# Altium project TIDA-010933-RevA.PrjPcb (part 3 of 8)

## Sheet TIDA-010933-DCDC-HVGAN.SchDoc
size 431 x 279 mm; Date: Not shown in title block; ApprovedBy: Not shown in title block; CheckedBy: Not shown in title block; Author: Not shown in title block; CompanyName: Not shown in title block; Engineer: Not shown in title block; Organization: Not shown in title block; Address1: Not shown in title block; Address2: Not shown in title block; Address3: Not shown in title block; Address4: Not shown in title block; DocumentNumber: 2; Revision: Use project parameter SCH_Rev; SheetNumber: 4; SheetTotal: 11; PageSetup: Record=PageOptions|CenterHorizontal=True|CenterVertical=True|PrintScale=1.00|XCorrection=1.00|YCorrection=1.00|PrintKind=0|BorderSize=5000000|LeftOffset=0|BottomOffset=0|Orientation=2|PaperLength=1000|PaperWidth=1000|Scale=100|PaperSource=15|PrintQuality=600|MediaType=1|DitherType=10|PaperKind=Letter|PrintScaleMode=1; CurrentTime: Not shown in title block; CurrentDate: Not shown in title block; Time: Not shown in title block; DocumentFullPathAndName: Not shown in title block; DocumentName: Not shown in title block; ModifiedDate: 1/25/2022; ImagePath: Not shown in title block
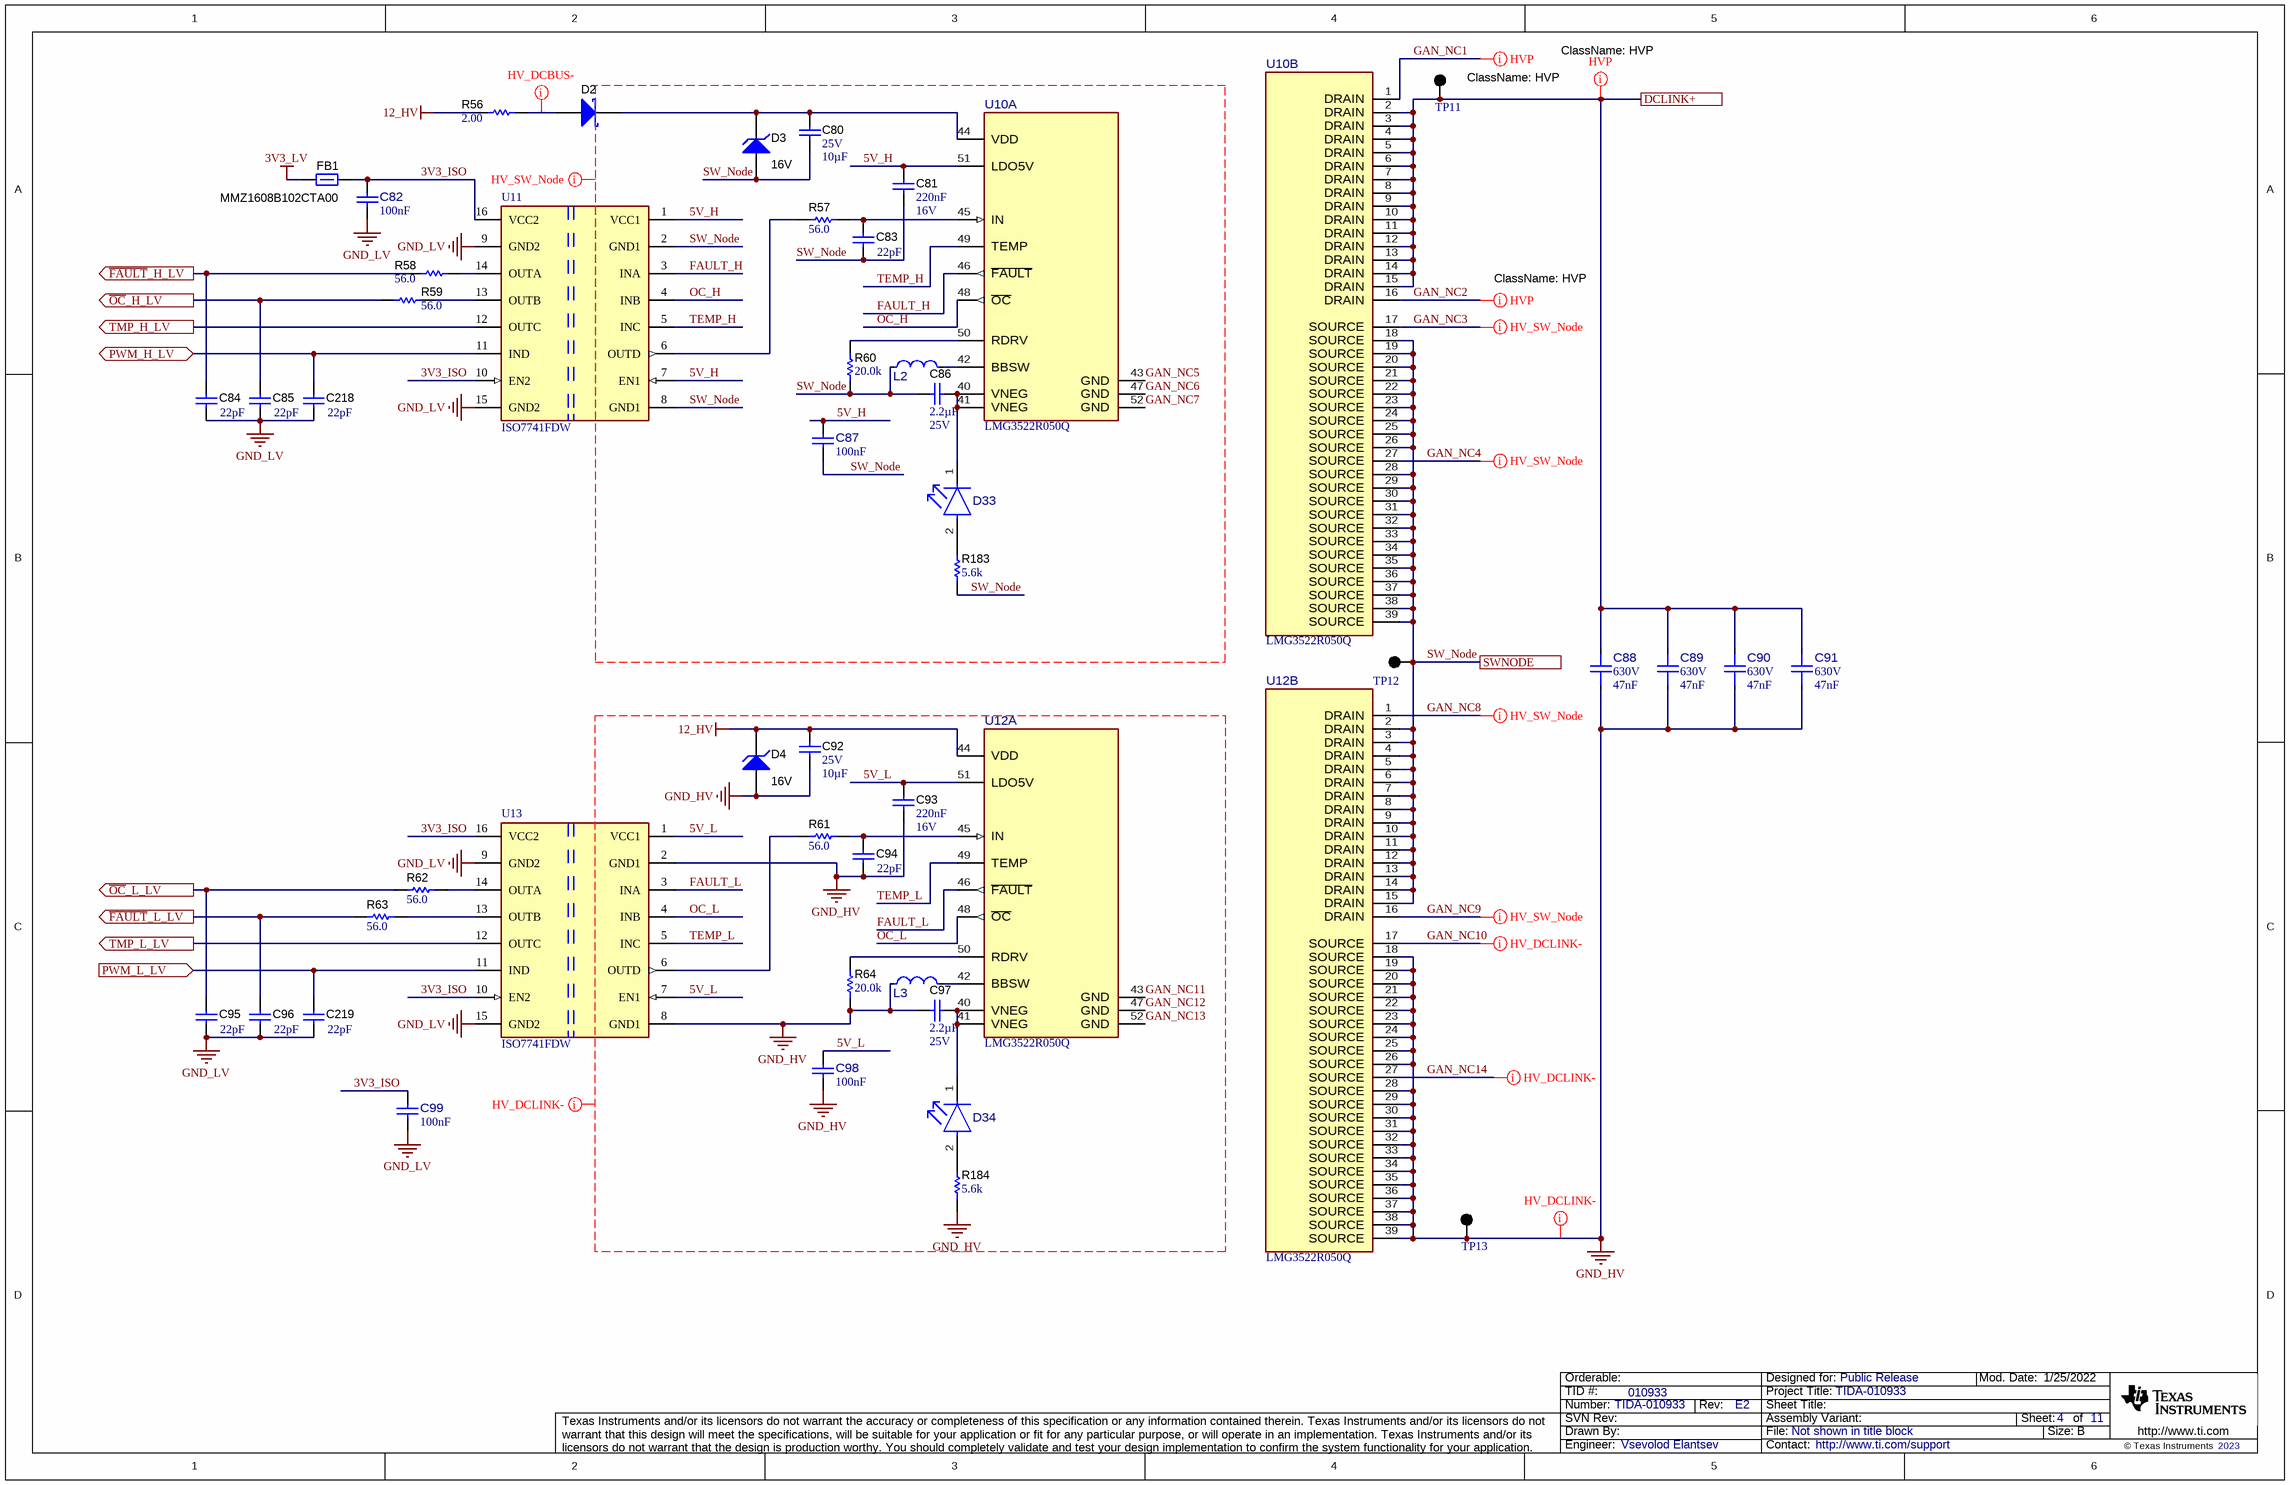
[diagram p3: TIDA-010933-DCDC-HVGAN.SchDoc]

### Parts
C80  VDC_V: 25V  ValueDisplayed: 10µF  [1206_180]  (hidden comment: TMK316AB7106KLHT)
C81  Cap_F: 220nF  VDC_V: 16V  [0603]  (hidden comment: GRM188R71C224KA01D)
C82  Cap_F: 100nF  [FP-CL10B104KB8NNNC_0603-IPC_B]  (hidden comment: CL10B104KB8NNNC)
C83  ValueDisplayed: 22pF  [0603]  (hidden comment: GRM1885C1H220JA01D)
C84  ValueDisplayed: 22pF  [0603]  (hidden comment: GRM1885C1H220JA01D)
C85  ValueDisplayed: 22pF  [0603]  (hidden comment: GRM1885C1H220JA01D)
C86  Cap_F: 2.2µF  VDC_V: 25V  [0805_HV]  (hidden comment: CGA4J3X7R1E225K125AB)
C87  Cap_F: 100nF  [FP-CL10B104KB8NNNC_0603-IPC_B]  (hidden comment: CL10B104KB8NNNC)
C88  VDC_V: 630V  ValueDisplayed: 47nF  [FP-C4532C0G2J473J320KA_1812-MFG]  (hidden comment: C4532C0G2J473J320KA)
C89  VDC_V: 630V  ValueDisplayed: 47nF  [FP-C4532C0G2J473J320KA_1812-MFG]  (hidden comment: C4532C0G2J473J320KA)
C90  VDC_V: 630V  ValueDisplayed: 47nF  [FP-C4532C0G2J473J320KA_1812-MFG]  (hidden comment: C4532C0G2J473J320KA)
C91  VDC_V: 630V  ValueDisplayed: 47nF  [FP-C4532C0G2J473J320KA_1812-MFG]  (hidden comment: C4532C0G2J473J320KA)
C92  VDC_V: 25V  ValueDisplayed: 10µF  [1206_180]  (hidden comment: TMK316AB7106KLHT)
C93  Cap_F: 220nF  VDC_V: 16V  [0603]  (hidden comment: GRM188R71C224KA01D)
C94  ValueDisplayed: 22pF  [0603]  (hidden comment: GRM1885C1H220JA01D)
C95  ValueDisplayed: 22pF  [0603]  (hidden comment: GRM1885C1H220JA01D)
C96  ValueDisplayed: 22pF  [0603]  (hidden comment: GRM1885C1H220JA01D)
C97  Cap_F: 2.2µF  VDC_V: 25V  [0805_HV]  (hidden comment: CGA4J3X7R1E225K125AB)
C98  Cap_F: 100nF  [FP-CL10B104KB8NNNC_0603-IPC_B]  (hidden comment: CL10B104KB8NNNC)
C99  Cap_F: 100nF  [FP-CL10B104KB8NNNC_0603-IPC_B]  (hidden comment: CL10B104KB8NNNC)
C218  ValueDisplayed: 22pF  [0603]  (hidden comment: GRM1885C1H220JA01D)
C219  ValueDisplayed: 22pF  [0603]  (hidden comment: GRM1885C1H220JA01D)
D2  GB01SLT06-214  [SMB]  (value not drawn)
D3  value 16V  [SOD-123]  (hidden comment: BZT52C16-7-F)
D4  value 16V  [SOD-123]  (hidden comment: BZT52C16-7-F)
D33  KG DELLS1.22-JGKH-24  [FP-KG DELLS1.22-JGKH-24_0603-MFG]  (value not drawn)
D34  KG DELLS1.22-JGKH-24  [FP-KG DELLS1.22-JGKH-24_0603-MFG]  (value not drawn)
FB1  MMZ1608B102CTA00  [MMZ1608_095]
L2  SDEM20161T-4R7MS  [FP-SDEM20161T-4R7MS_SMD2-MFG]  (value not drawn)
L3  SDEM20161T-4R7MS  [FP-SDEM20161T-4R7MS_SMD2-MFG]  (value not drawn)
R56  ValueDisplayed: 2.00  [0805_HV]  (hidden comment: CRCW08052R00FKEA)
R57  ValueDisplayed: 56.0  [0603]  (hidden comment: RC0603FR-0756RL)
R58  ValueDisplayed: 56.0  [0603]  (hidden comment: RC0603FR-0756RL)
R59  ValueDisplayed: 56.0  [0603]  (hidden comment: RC0603FR-0756RL)
R60  ValueDisplayed: 20.0k  [0603]  (hidden comment: RC0603FR-0720KL)
R61  ValueDisplayed: 56.0  [0603]  (hidden comment: RC0603FR-0756RL)
R62  ValueDisplayed: 56.0  [0603]  (hidden comment: RC0603FR-0756RL)
R63  ValueDisplayed: 56.0  [0603]  (hidden comment: RC0603FR-0756RL)
R64  ValueDisplayed: 20.0k  [0603]  (hidden comment: RC0603FR-0720KL)
R183  ValueDisplayed: 5.6k  [0603]  (hidden comment: RC0603JR-075K6L)
R184  ValueDisplayed: 5.6k  [0603]  (hidden comment: RC0603JR-075K6L)
TP11  5001  [Keystone5001]  (value not drawn)
TP12  5001  [Keystone5001]  (value not drawn)
TP13  5001  [Keystone5001]  (value not drawn)
U10  PartNumber: LMG3522R050Q  [RQS0052C-C01-MFG]  (hidden comment: LMG3522R030Q)  (parts A,B of 2)
U11  ISO7741FDW  [FP-DW0016A-IPC_A]
U12  PartNumber: LMG3522R050Q  [RQS0052C-C01-MFG]  (hidden comment: LMG3522R030Q)  (parts A,B of 2)
U13  ISO7741FDW  [FP-DW0016A-IPC_A]

### Ports
DCLINK+, PWM_H_LV (bidir), PWM_L_LV (in), SWNODE, TMP_H_LV (out), TMP_L_LV (out), ~{FAULT}_H_LV (out), ~{FAULT}_L_LV (out), ~{OC}_H_LV (out), ~{OC}_L_LV (out)

### Nets
3V3_LV: FB1.1  [project net 3V3]
12_HV: C92.1 D4.1(K) R56.1 U12.44(VDD)
GND_HV: C88.1 C89.1 C90.1 C91.1 C92.2 C93.2 C94.2 C97.2 C98.2 D4.2(A) L3.1 R64.1 R184.1 TP13.1 U12.18(SOURCE) U12.19(SOURCE) U12.20(SOURCE) U12.21(SOURCE) U12.22(SOURCE) U12.23(SOURCE) U12.24(SOURCE) U12.25(SOURCE) U12.26(SOURCE) U12.28(SOURCE) U12.29(SOURCE) U12.30(SOURCE) U12.31(SOURCE) U12.32(SOURCE) U12.33(SOURCE) U12.34(SOURCE) U12.35(SOURCE) U12.36(SOURCE) U12.37(SOURCE) U12.38(SOURCE) U12.39(SOURCE) U13.2(GND1) U13.8(GND1)
GND_LV: C82.2 C84.2 C85.2 C95.2 C96.2 C99.2 C218.2 C219.2 U11.9(GND2) U11.15(GND2) U13.9(GND2) U13.15(GND2)  [project net GND]
3V3_ISO: C82.1 C99.1 FB1.2 U11.10(EN2) U11.16(VCC2) U13.10(EN2) U13.16(VCC2)
5V_H: C81.1 C87.1 U10.51(LDO5V) U11.1(VCC1) U11.7(EN1)
5V_L: C93.1 C98.1 U12.51(LDO5V) U13.1(VCC1) U13.7(EN1)
DCLINK+_HV: C88.2 C89.2 C90.2 C91.2 TP11.1 U10.2(DRAIN) U10.3(DRAIN) U10.4(DRAIN) U10.5(DRAIN) U10.6(DRAIN) U10.7(DRAIN) U10.8(DRAIN) U10.9(DRAIN) U10.10(DRAIN) U10.11(DRAIN) U10.12(DRAIN) U10.13(DRAIN) U10.14(DRAIN) U10.15(DRAIN) ; port DCLINK+
FAULT_H: U10.46(~{FAULT}) U11.3(INA)
FAULT_L: U12.46(~{FAULT}) U13.3(INA)
GAN_NC1: U10.1(DRAIN)
GAN_NC2: U10.16(DRAIN)
GAN_NC3: U10.17(SOURCE)
GAN_NC4: U10.27(SOURCE)
GAN_NC5: U10.43(GND)
GAN_NC6: U10.47(GND)
GAN_NC7: U10.52(GND)
GAN_NC8: U12.1(DRAIN)
GAN_NC9: U12.16(DRAIN)
GAN_NC10: U12.17(SOURCE)
GAN_NC11: U12.43(GND)
GAN_NC12: U12.47(GND)
GAN_NC13: U12.52(GND)
GAN_NC14: U12.27(SOURCE)
LLC_SR_~{FAULT}_H: C84.1 R58.1 ; port ~{FAULT}_H_LV
LLC_SR_~{FAULT}_L: C96.1 R63.1 ; port ~{FAULT}_L_LV
LLC_SR_H: C218.1 U11.11(IND) ; port PWM_H_LV
LLC_SR_L: C219.1 U13.11(IND) ; port PWM_L_LV
LLC_SR_~{OC}_H: C85.1 R59.1 ; port ~{OC}_H_LV
LLC_SR_~{OC}_L: C95.1 R62.1 ; port ~{OC}_L_LV
LLC_SR_TMP_H: U13.12(OUTC) ; port TMP_L_LV
LLC_SR_TMP_L: U11.12(OUTC) ; port TMP_H_LV
OC_H: U10.48(~{OC}) U11.4(INB)
OC_L: U12.48(~{OC}) U13.4(INB)
SW_Node: C80.2 C81.2 C83.2 C86.2 C87.2 D3.2(A) L2.1 R60.1 R183.1 TP12.1 U10.18(SOURCE) U10.19(SOURCE) U10.20(SOURCE) U10.21(SOURCE) U10.22(SOURCE) U10.23(SOURCE) U10.24(SOURCE) U10.25(SOURCE) U10.26(SOURCE) U10.28(SOURCE) U10.29(SOURCE) U10.30(SOURCE) U10.31(SOURCE) U10.32(SOURCE) U10.33(SOURCE) U10.34(SOURCE) U10.35(SOURCE) U10.36(SOURCE) U10.37(SOURCE) U10.38(SOURCE) U10.39(SOURCE) U11.2(GND1) U11.8(GND1) U12.2(DRAIN) U12.3(DRAIN) U12.4(DRAIN) U12.5(DRAIN) U12.6(DRAIN) U12.7(DRAIN) U12.8(DRAIN) U12.9(DRAIN) U12.10(DRAIN) U12.11(DRAIN) U12.12(DRAIN) U12.13(DRAIN) U12.14(DRAIN) U12.15(DRAIN) ; port SWNODE
TEMP_H: U10.49(TEMP) U11.5(INC)
TEMP_L: U12.49(TEMP) U13.5(INC)
NetC80_1: C80.1 D2.1(K) D3.1(K) U10.44(VDD)
NetC83_1: C83.1 R57.2 U10.45(IN)
NetC86_1: C86.1 D33.1(CATHODE) U10.40(VNEG) U10.41(VNEG)
NetC94_1: C94.1 R61.2 U12.45(IN)
NetC97_1: C97.1 D34.1(CATHODE) U12.40(VNEG) U12.41(VNEG)
NetD2_2: D2.2(A) R56.2
NetD33_2: D33.2(ANODE) R183.2
NetD34_2: D34.2(ANODE) R184.2
NetL2_2: L2.2 U10.42(BBSW)
NetL3_2: L3.2 U12.42(BBSW)
NetR57_1: R57.1 U11.6(OUTD)
NetR58_2: R58.2 U11.14(OUTA)
NetR59_2: R59.2 U11.13(OUTB)
NetR60_2: R60.2 U10.50(RDRV)
NetR61_1: R61.1 U13.6(OUTD)
NetR62_2: R62.2 U13.14(OUTA)
NetR63_2: R63.2 U13.13(OUTB)
NetR64_2: R64.2 U12.50(RDRV)

### Layout directives
net class HV_SW_Node: 5V_H, FAULT_H, GAN_NC3, GAN_NC4, GAN_NC5, GAN_NC6, GAN_NC7, GAN_NC8, GAN_NC9, OC_H, SW_Node, TEMP_H
net class HV_DCBUS-: NetD2_2
net class HV_DCLINK-: 5V_L, 12_HV, FAULT_L, GAN_NC10, GAN_NC11, GAN_NC12, GAN_NC13, GAN_NC14, GND_HV, OC_L, TEMP_L
net class HVP: DCLINK+_HV, GAN_NC1, GAN_NC2

### Notes on the sheet
- Drawn By:
- SVN Rev:
- Number:
- TID #:
- Orderable:
- Rev:
- Sheet Title:
- File:
- Project Title:
- Designed for:
- Assembly Variant:
- Mod. Date:
- Sheet:
- Size:
- of
- B
- http://www.ti.com
- Texas Instruments and/or its licensors do not warrant the accuracy or completeness of this specification or any information contained therein. Texas Instruments and/or its licensors do not warrant that this design will meet the specifications, will be suitable for your application or fit for any particular purpose, or will operate in an implementation. Texas Instruments and/or its licensors do not warrant that the design is production worthy. You should completely validate and test your design implementation to confirm the system functionality for your application.
- Engineer:
- Contact:
- © Texas Instruments

### Library data of the parts
C80 C92 = CMP-0750154-1: CAP, CERM, 10 µF, 25 V,+/- 10%, X7R, AEC-Q200 Grade 1, 1206; Manufacturer: Taiyo Yuden; AEC Qualified: Y; SizeZ_mm: 1.8; TaMax_C: 125°C; TaMin_C: -55°C; Cap_Case: 1206; Polarized: N; AEC Grade: 1; SizeY_mm: 1.6; Value: 10uF; SizeX_mm: 3.2; SizeAreaWB_mm2: 10.92; AEC Category: Q200; U/M: EA; SizeArea_mm2: 5.12; Technology: Ceramic; TempCo: X7R; CompType: Capacitor; RoHS: Y; PackageReference: 1206; MountType: SMT; Cap_F: 10µF; ComponentLink1URL: https://www.yuden.co.jp/productdata/catalog/mlcc_all_hq_e.pdf; Tolerance_%: 10%; ComponentLink1Description: Datasheet link; PartNumber: TMK316AB7106KLHT; Value2: 25V
C81 C93 = CMP-0007389-4: CAP, CERM, 0.22 uF, 16 V, +/- 10%, X7R, 0603; Manufacturer: MuRata; TaMin_C: -55°C; Polarized: N; SizeAreaWB_mm2: 4.68; Value1: Unknown; U/M: EA; Value: 0.22uF; TaMax_C: 125°C; SizeZ_mm: 1; SizeX_mm: 1.6; SizeY_mm: 0.8; SizeArea_mm2: 1.28; AEC Category: Q200; Supplier Part Number 2: 81-GRM188R71C224KA01; Publisher: Texas Instruments; Supplier 2: Mouser; Supplier Part Number 3: 1828891; TempCo: X7R; Supplier 3: Farnell; Published: 2008-06-19; RoHS: Y; MountType: SMT; Supplier 1: Digi-Key; PackageReference: 0603; Tolerance_%: 10%; Cap_Case: 0603; Value2: 16V; CompType: Capacitor; LatestRevisionDate: 2017-03-09; PartNumber: GRM188R71C224KA01D; AEC Qualified: ?; ComponentLink1Description: Datasheet link; Supplier Part Number 1: 490-3293-1-ND; Technology: Ceramic; ValueDisplayed: 0.22uF; ComponentLink1URL: http://search.murata.co.jp/Ceramy/PnsearchViewAction.do?HnOFG=ON&HnNFG=ON&SEL_CNT=50&sLang=en&sKey=GRM188R71C224KA01D&x=9&y=9&search=startwith
C82 C87 C98 C99 = CMP-0087079-2: CAP CER 0.1UF 50V X7R 0603; Manufacturer: Samsung; SizeZ_mm: 0.9mm; AEC Qualified: No; TempCo: 15%; Symbol Name: SYM-CL10B104KB8NNNC; Tolerance_%: 10%; ComponentLink1Description: Datasheet; PackageReference: 0603; RoHS: TRUE; ComponentLink1URL: http://www.samsungsem.com/kr/support/product-search/mlcc/__icsFiles/afieldfile/2018/07/24/CL10B104KB8NNNC.pdf; VDC_V: 50V; PartNumber: CL10B104KB8NNNC
C83-C85 C94-C96 C218 C219 = CMP-0007196-3: CAP, CERM, 22 pF, 50 V, +/- 5%, C0G/NP0, 0603; Manufacturer: MuRata; TaMin_C: -55°C; Polarized: N; SizeAreaWB_mm2: 4.68; Value1: Unknown; U/M: EA; Value: 22pF; TaMax_C: 125°C; SizeZ_mm: 1; SizeX_mm: 1.6; SizeY_mm: 0.8; Value2: 50V; SizeArea_mm2: 1.28; AEC Category: Q200; Supplier Part Number 2: 81-GRM39C220J50; Publisher: Texas Instruments; Supplier 2: Mouser; Supplier Part Number 3: 8819831; TempCo: C0G/NP0; Supplier 3: Farnell; Published: 2008-06-19; RoHS: Y; MountType: SMT; Supplier 1: Digi-Key; PackageReference: 0603; Tolerance_%: 5%; Cap_Case: 0603; CompType: Capacitor; LatestRevisionDate: 2017-03-09; PartNumber: GRM1885C1H220JA01D; AEC Qualified: ?; Cap_F: 22pF; VDC_V: 50V; ComponentLink1Description: Datasheet link; Supplier Part Number 1: 490-1411-1-ND; Technology: Ceramic; ComponentLink1URL: http://search.murata.co.jp/Ceramy/PnsearchViewAction.do?HnOFG=ON&HnNFG=ON&SEL_CNT=50&sLang=en&sKey=GRM1885C1H220JA01D&x=9&y=9&search=startwith
C86 C97 = CMP-0007975-2: CAP, CERM, 2.2 uF, 25 V, +/- 10%, X7R, AEC-Q200 Grade 1, 0805; Manufacturer: TDK; TaMin_C: -55°C; Polarized: N; SizeAreaWB_mm2: 6.75; Value1: Unknown; U/M: EA; Value: 2.2uF; TaMax_C: 125°C; SizeZ_mm: 1.45; SizeX_mm: 2; SizeY_mm: 1.25; Cap_Case: 0805; SizeArea_mm2: 2.5; AEC Qualified: Y; AEC Grade: 1; AEC Category: Q200; Supplier Part Number 2: 39Y3548; Publisher: Texas Instruments; Supplier 2: Newark; Supplier Part Number 3: 810-CGA4J3X7R1E225K; TempCo: X7R; Supplier 3: Mouser; Published: 2008-06-19; RoHS: Y; MountType: SMT; Supplier 1: Digi-Key; PackageReference: 0805; Tolerance_%: 10%; Value2: 25V; CompType: Capacitor; LatestRevisionDate: 2017-03-09; PartNumber: CGA4J3X7R1E225K125AB; ComponentLink1Description: Datasheet link; Supplier Part Number 1: 445-6965-1-ND; Technology: Ceramic; ValueDisplayed: 2.2uF; ComponentLink1URL: https://product.tdk.com/info/en/documents/chara_sheet/CGA4J3X7R1E225K125AB.pdf
C88-C91 = CMP-0091479-1: C Series 1812 0.047 uF 630 V ±5% Tolerance C0G/NP0 Multilayer Ceramic Capacitor; Manufacturer: TDK; SizeZ_mm: 3.5mm; Value: 47nF; Temperature Characteristic: C0G; AEC Qualified: No; TempCo: 30ppm/°C; Digikey Part Number: 445-14979-1-ND; Part Number: C4532C0G2J473J320KA; Supplier Part Number 2: 810-C4532C0G2J473JKA; Mouser Description: Multilayer Ceramic Capacitors MLCC - SMD/SMT C4532C0G2J473JT000N; Digikey Description: CAP CER 0.047UF 630V C0G 1812; Datasheet Path: datasheets/Cap-C4532C0G2J473J320KA.pdf; Supplier 2: Mouser; helpURL: https://upverter.com/upn/revision/1db5e60618c374e3/; Supplier Part Number 1: 445-14979-1-ND; Operating Temperature Range: -55°C to +125°C; PackageReference: 1812; datasheet: https://product.tdk.com/info/en/catalog/datasheets/mlcc_commercial_midvoltage_en.pdf; Lead Free: Yes; Mouser Part Number: 810-C4532C0G2J473JKA; Cap_F: 47nF; ComponentLink1Description: Datasheet; RoHS: TRUE; Supplier 1: Digikey; Tolerance_%: 5%; PartNumber: C4532C0G2J473J320KA; ComponentLink1URL: https://product.tdk.com/info/en/catalog/datasheets/mlcc_commercial_midvoltage_en.pdf
D2 = CMP-0076998-2: Diode, Schottky, 650 V, 1 A, SMB; Manufacturer: GeneSiC Semiconductor; Value1: 1A; SizeZ_mm: 2.6; Value: 650V; SizeAreaWB_mm2: 44.156; TJmax_C: 175°C; RJC_CperW: 3.55; SizeArea_mm2: 21.336; AEC Category: Q101; Value2: 2V; SizeY_mm: 3.81; SizeX_mm: 5.6; PackageReference: SMB; AEC Qualified: ?; MountType: SMT; Io_A: 1A; ComponentLink1URL: http://www.genesicsemi.com/images/products_sic/rectifiers/GB01SLT06-214.pdf; RoHS: Y; PartNumber: GB01SLT06-214; Vr_V: 650V; Type: Schottky; CompType: Diode; ComponentLink1Description: Datasheet link; Vf_V: 2V
D3 D4 = CMP-0005769-4: Diode, Zener, 16 V, 500 mW, AEC-Q101, SOD-123; Manufacturer: Diodes Inc.; SizeZ_mm: 1.35; AEC Qualified: Y; SizeX_mm: 3.85; AEC Category: Q101; Power_W: 500mW; SizeY_mm: 1.7; Value1: 0.5W; SizeAreaWB_mm2: 13.095; SizeArea_mm2: 6.545; RJA_CperW: 338; CompType: Zener; PackageReference: SOD-123; ComponentLink1URL: http://www.diodes.com/_files/datasheets/ds18004.pdf; Vz_V: 16V; ComponentLink1Description: Datasheet link; PartNumber: BZT52C16-7-F; RoHS: Y; MountType: SMT
D33 D34 = CMP-0093310-1: Standard LEDs - SMD Green TOPLED E 1608; Manufacturer: Osram Opto; AEC Grade: Grade 2; LambdaP: 572nm; SizeZ_mm: 0.7mm; LuminousFlux_PhiV: 0.016-0.0295lm; Luminous Intensity: 4.5-9.7mcd; LambdaD: 570nm; Tjmax_C: 125°C; Angle: 120°; Led Orientation: Top View; Forward Current: 2mA; Vf_V: 1.8V; AEC Qualified: Yes; Vr_V: 12V; Lead Free: Yes; Part Number: KG DELLS1.22-JGKH-24; ComponentLink1URL: https://dammedia.osram.info/media/resource/hires/osram-dam-5423212/KG%20DELLS1.22_EN.pdf; Mouser Description: Topled E1608 Grn SMT; helpURL: https://upverter.com/upn/revision/bca93164397fc6ea/; PackageReference: 0603; ComponentLink1Description: Datasheet; PartNumber: KG DELLS1.22-JGKH-24; Datasheet Path: datasheets/Diode-KG DELLS1.22-JGKH-24.pdf; RoHS: TRUE; Mouser Part Number: 720-KGDELLS122A4849; Operating Temperature Range: -40°C to +110°C; datasheet: https://dammedia.osram.info/media/resource/hires/osram-dam-5423212/KG%20DELLS1.22_EN.pdf; Color: Green
FB1 = CMP-0003416-1: Ferrite Bead, 1000 ohm @ 100 MHz, 0.3 A, 0603; Manufacturer: TDK; ZTyp@100MHz_Ohm: 1k; DCR_ohm: 0.6; Value1: 0.6 ohm; Imax_A: 300mA; Value2: 0.3A; ComponentLink1URL: http://product.tdk.com/emc/beads/en/documents/beads_commercial_signal_mmz_en.pdf; Supplier Part Number 2: 88T9800; Publisher: Texas Instruments; Supplier 2: Newark; Published: 2014-04-30; RoHS: Y; MountType: SMT; Value: 1000 ohm; Supplier 1: Digi-Key; PackageReference: 0603; CompType: Ferrite Bead; LatestRevisionDate: 2017-03-09; PartNumber: MMZ1608B102CTA00; ComponentLink1Description: Datasheet link; Supplier Part Number 1: 445-8672-1-ND; ValueDisplayed: 1000 ohm
L2 L3 = CMP-0089347-1: 4.7µH Unshielded Inductor 1.1A 426mOhm Max 0806 (2016 Metric); Manufacturer: Cyntec; AEC Qualified: No; Material: Metal Dust; Isat: 1.26A; Test Frequency: 1MHz; DCR_ohm: 0.426; SizeZ_mm: 1mm; Tolerance_%: 20%; Operating Temperature Range: -55°C to +125°C; Datasheet Path: datasheets/Ind-SDEM20161T-4R7MS.pdf; Technology: Wirewound; PartNumber: SDEM20161T-4R7MS; helpURL: https://upverter.com/upn/revision/c351dd411625336f/; PackageReference: SMD2; RoHS: TRUE; Supplier 1: Digikey; datasheet: http://www.cyntec.com/upfile/products/download/SDEM20161T-000%20(A4).pdf; Lead Free: Yes; Device Class L2: Inductors; Device Class L3: Fixed Inductors; Device Class L1: Passive Components; ComponentLink1URL: http://www.cyntec.com/upfile/products/download/SDEM20161T-000%20(A4).pdf; Ind_H: 4.7µH; Irms: 1.1A; Digikey Description: FIXED IND 4.7UH 1.1A 426MOHM SMD; Supplier Part Number 1: 2037-SDEM20161T-4R7MSCT-ND; Digikey Part Number: 2037-SDEM20161T-4R7MSCT-ND; ComponentLink1Description: Datasheet; Part Number: SDEM20161T-4R7MS
R56 = CMP-0021141-3: RES, 2.00, 1%, 0.125 W, AEC-Q200 Grade 0, 0805; Manufacturer: Vishay-Dale; Power_W: 125mW; TempCo: 100 ppm/C; Value_Code: 2R00; Value: 2.00; EIA_Code: E96; Res_ohm: 2; SizeY_mm: 1.25; SizeZ_mm: 1.45; Value2: 0.125W; SizeArea_mm2: 2.5; AEC Qualified: Y; VDC_V: 150V; AEC Category: Q200; AEC Grade: 0; Supplier Part Number 2: 71-CRCW08052R00FKEA; Supplier 2: Mouser; Supplier Part Number 3: 1862024; Supplier 3: Farnell; RoHS: E; Value1: 1%; MountType: SMT; Supplier 1: Digi-Key; PackageReference: 0805; Tolerance_%: 1%; SizeX_mm: 2; CompType: Resistor; PartNumber: CRCW08052R00FKEA; ComponentLink1Description: Datasheet link; Supplier Part Number 1: 541-2.00CCCT-ND; Technology: Thick Film; ComponentLink1URL: http://www.vishay.com/docs/20035/dcrcwe3.pdf
R57-R59 R61-R63 = CMP-0023188-5: RES, 56.0, 1%, 0.1 W, 0603; Manufacturer: Yageo; Power_W: 100mW; TempCo: 100 ppm/C; Value_Code: 56R0; Value: 56.0; Res_ohm: 56; SizeX_mm: 1.6; SizeY_mm: 0.8; SizeZ_mm: 1; Value2: 0.1W; SizeArea_mm2: 1.28; AEC Qualified: N; VDC_V: 75V; AEC Category: Q200; SizeAreaWB_mm2: 4.68; Supplier Part Number 2: 603-RC0603FR-0756RL; Supplier 2: Mouser; Supplier Part Number 3: 9238336; Supplier 3: Farnell; RoHS: Y; Value1: 1%; MountType: SMT; Supplier 1: Digi-Key; PackageReference: 0603; Tolerance_%: 1%; CompType: Resistor; PartNumber: RC0603FR-0756RL; ComponentLink1Description: Datasheet link; Supplier Part Number 1: 311-56.0HRCT-ND; Technology: Thick Film; ComponentLink1URL: http://www.yageo.com/pdf/Pu-RC0603_51_PbFree_L_2.pdf; AEC Grade: N/A
R60 R64 = CMP-0022906-5: RES, 20.0 k, 1%, 0.1 W, 0603; Manufacturer: Yageo; Power_W: 100mW; TempCo: 100 ppm/C; Value_Code: 20k0; Value: 20.0k; EIA_Code: E96; Res_ohm: 20k; SizeX_mm: 1.6; SizeY_mm: 0.8; SizeZ_mm: 1; Value2: 0.1W; SizeArea_mm2: 1.28; AEC Qualified: N; VDC_V: 75V; AEC Category: Q200; SizeAreaWB_mm2: 4.68; Supplier Part Number 2: 603-RC0603FR-0720KL; Supplier 2: Mouser; Supplier Part Number 3: 1799331; Supplier 3: Farnell; RoHS: Y; Value1: 1%; MountType: SMT; Supplier 1: Digi-Key; PackageReference: 0603; Tolerance_%: 1%; CompType: Resistor; PartNumber: RC0603FR-0720KL; ComponentLink1Description: Datasheet link; Supplier Part Number 1: 311-20.0KHRCT-ND; Technology: Thick Film; ComponentLink1URL: http://www.yageo.com/pdf/Pu-RC0603_51_PbFree_L_2.pdf; AEC Grade: N/A
R183 R184 = CMP-0025933-5: RES, 5.6 k, 5%, 0.1 W, 0603; Manufacturer: Yageo; Power_W: 100mW; TempCo: 100 ppm/C; Value_Code: 5k60; Value: 5.6k; EIA_Code: E24; SizeX_mm: 1.6; SizeY_mm: 0.8; SizeZ_mm: 1; Value2: 0.1W; SizeArea_mm2: 1.28; AEC Qualified: N; VDC_V: 75V; AEC Category: Q200; SizeAreaWB_mm2: 4.68; Supplier Part Number 2: 603-RC0603JR-075K6L; Supplier 2: Mouser; Supplier Part Number 3: 9233474; Supplier 3: Farnell; RoHS: Y; Value1: 5%; MountType: SMT; Supplier 1: Digi-Key; PackageReference: 0603; Tolerance_%: 5%; Res_ohm: 5.6k; CompType: Resistor; PartNumber: RC0603JR-075K6L; ComponentLink1Description: Datasheet link; Supplier Part Number 1: 311-5.6KGRCT-ND; Technology: Thick Film; ComponentLink1URL: http://www.yageo.com/pdf/Pu-RC0603_51_PbFree_L_2.pdf; AEC Grade: N/A
TP11-TP13 = CMP-0055138-2: Test Point, Miniature, Black, TH; Manufacturer: Keystone Electronics; ContactFinish: Silver; CNHeader: FALSE; Green_Lifecycle: Active; Green_REACh: Passed; CT: TRUE; Color: Black; PackageReference: Black Miniature Testpoint; LatestRevisionDate: 26/05/2017; MountType: TH; Publisher: Texas Instruments; Green_EU RoHS-2: Incomplete; PartNumber: 5001; Supplier 1: Digi-Key; Supplier Part Number 1: 36-5001-ND; ComponentLink1URL: http://www.keyelco.com/userAssets/file/M60-2p60.pdf; ComponentLink1Description: Datasheet URL; RoHS: Y; Supplier 2: Mouser; Green_EU RoHS: Passed; CompType: Test Point; Supplier Part Number 2: 534-5001
U10 U12 = CMP-0089967-3: 650-V 30-mΩ GaN FET with Integrated Driver and Protection; Manufacturer: Texas Instruments; Standoff Height: 0mm; TJmax_C: +125°C; AEC Qualified: Yes; Nominal Supply Current: 16mA; Min Supply Voltage: 7.5V; SizeZ_mm: 1mm; AEC Category: Q200; Output Voltage: 520V; CompType: IC; Number Of Outputs: 1; Max Supply Voltage: 18V; AEC Grade: Grade 1; PackageReference: VQFN52; Datasheet Path: datasheets/IC-LMG3522R030Q.pdf; helpURL: https://upverter.com/upn/revision/5d47e7f0436b8598/; RoHS: UNKNOWN; ComponentLink3Description: Online Datasheet; Operating Temperature Range: -40°C to +125°C; ComponentLink1Description: Datasheet Link; ComponentLink3URL: http://www.ti.com/product/GPN/datasheet; ComponentLink2Description: Product Folder; ComponentLink2URL: http://www.ti.com/product/GPN; Part Number: LMG3522R050Q; ComponentLink1URL: http://www.ti.com/lit/ds/symlink/GPN.pdf; PartId: 1
U11 U13 = CMP-04872-000092-1: DGTL ISO 5000VRMS 4CH GP 16SOIC; Manufacturer: Texas Instruments; Number of Channels: 4; Max Supply Voltage: 5.5V; Min Supply Voltage: 2.25V; Propagation Delay: 10.7ns; RoHS Compliant: Yes; Lead Free: Lead Free; Min Operating Temperature: -55°C; Number of Pins: 16; Max Operating Temperature: 125°C; Case/Package: SOIC; PartNumber: ISO7741FDW

## Sheet TIDA-010933-DCDC-Hardware.SchDoc
size 431 x 279 mm; Date: Not shown in title block; ApprovedBy: Not shown in title block; CheckedBy: Not shown in title block; Author: Not shown in title block; CompanyName: Not shown in title block; Engineer: Not shown in title block; Organization: Not shown in title block; Address1: Not shown in title block; Address2: Not shown in title block; Address3: Not shown in title block; Address4: Not shown in title block; DocumentNumber: 3; Revision: Use project parameter SCH_Rev; SheetNumber: 8; SheetTotal: 11; PageSetup: Record=PageOptions|CenterHorizontal=True|CenterVertical=True|PrintScale=1.00|XCorrection=1.00|YCorrection=1.00|PrintKind=0|BorderSize=5000000|LeftOffset=0|BottomOffset=0|Orientation=2|PaperLength=1000|PaperWidth=1000|Scale=100|PaperSource=15|PrintQuality=600|MediaType=1|DitherType=10|PaperKind=Letter|PrintScaleMode=1; CurrentTime: Not shown in title block; CurrentDate: Not shown in title block; Time: Not shown in title block; DocumentFullPathAndName: Not shown in title block; DocumentName: Not shown in title block; ModifiedDate: 1/25/2022; ImagePath: Not shown in title block
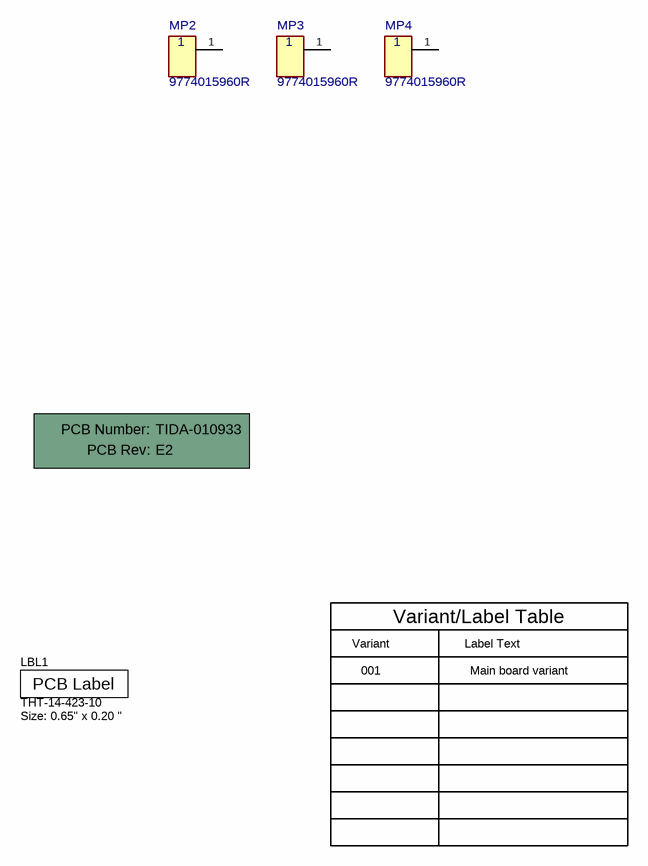
[diagram p4: TIDA-010933-DCDC-Hardware.SchDoc]

### Parts
!PCB2  Printed Circuit Board  (value not drawn)  (mechanical)
LBL1  THT-14-423-10  Note: Size: 0.65" x 0.20 "  [Label_650x200]
MP2  9774015960R  [FP-9774015960R_ROUND_SPACER_6MM0-MFG]
MP3  9774015960R  [FP-9774015960R_ROUND_SPACER_6MM0-MFG]
MP4  9774015960R  [FP-9774015960R_ROUND_SPACER_6MM0-MFG]

### Nets

Not connected (* = marked no-connect by the designer): MP2 1; MP3 1; MP4 1

### Notes on the sheet
- Variant
- Variant/Label Table
- Label Text
- 001
- Main board variant
- Drawn By:
- SVN Rev:
- Number:
- TID #:
- Orderable:
- Rev:
- Sheet Title:
- File:
- Project Title:
- Designed for:
- Assembly Variant:
- Mod. Date:
- Sheet:
- Size:
- of
- B
- http://www.ti.com
- Texas Instruments and/or its licensors do not warrant the accuracy or completeness of this specification or any information contained therein. Texas Instruments and/or its licensors do not warrant that this design will meet the specifications, will be suitable for your application or fit for any particular purpose, or will operate in an implementation. Texas Instruments and/or its licensors do not warrant that the design is production worthy. You should completely validate and test your design implementation to confirm the system functionality for your application.
- Engineer:
- Contact:
- © Texas Instruments
- (in symbol CMP-0003618-2) PCB Number:; PCB Rev:
- (in symbol CMP-0003625-1) PCB Label

### Library data of the parts
!PCB2 = CMP-0003618-2: Manufacturer: Any; PartNumber: TIDA-010933; CompType: PCB; RoHS: O; MountType: N/A; Publisher: Texas Instruments; LatestRevisionDate: 2017-03-09; Key: PCB
LBL1 = CMP-0003625-1: Thermal Transfer Printable Labels, 0.650" W x 0.200" H - 10,000 per roll; Manufacturer: Brady; CompType: Label; ClassName: Label; PartNumber: THT-14-423-10; RoHS: Y; PackageReference: PCB Label 0.650 x 0.200 inch; MountType: N/A; ComponentLink1Description: Web Page; ComponentLink1URL: http://www.bradyid.com/bradyid/pdpv/THT-14-423-10.html; Publisher: Texas Instruments; LatestRevisionDate: 2017-03-09; Supplier 1: Newark; Supplier Part Number 1: 97C5133; Supplier 2: Farnell; Supplier Part Number 2: 2065596; Key: THT-14-423-10
MP2-MP4 = CMP-0040203-1: Round Spacer Unthreaded Steel 0.059" (1.50mm); Manufacturer: Wurth Electronics; AEC Qualified: No; Is Female: yes; SizeZ_mm: 1.6mm; PackageReference: ROUND_SPACER_6MM0; PartNumber: 9774015960R; RoHS: TRUE; Supplier 1: Digikey; Supplier 2: Mouser; Supplier Part Number 1: 732-7071-1-ND; Supplier Part Number 2: 710-9774015960R; Part Number: 9774015960R; datasheet: https://www.we-online.com/components/products/datasheet/9774015960R.pdf; Datasheet Path: datasheets/UNK-9774015960R.pdf; Digikey Description: ROUND SPACER STEEL 1.5MM; Digikey Part Number: 732-7071-1-ND; helpURL: https://upverter.com/upn/revision/67a23d837871b5d5/; Lead Free: Yes; Mouser Description: Spacer Material: Steel Mounting: SMT Series: WA-SMST For ø: 3.3 mm; Mouser Part Number: 710-9774015960R; Operating Temperature Range: -55°C to +150°C; ComponentLink1Description: Datasheet; ComponentLink1URL: https://www.we-online.com/components/products/datasheet/9774015960R.pdf